# EasyEDA schematic SCH_Aether Zero_R0.5.json
TITLE: Aether Zero; REV: 0.4; Date: 2023-12-19; Sheet: 1/1; Drawn By: averseabfun; Company: (none)
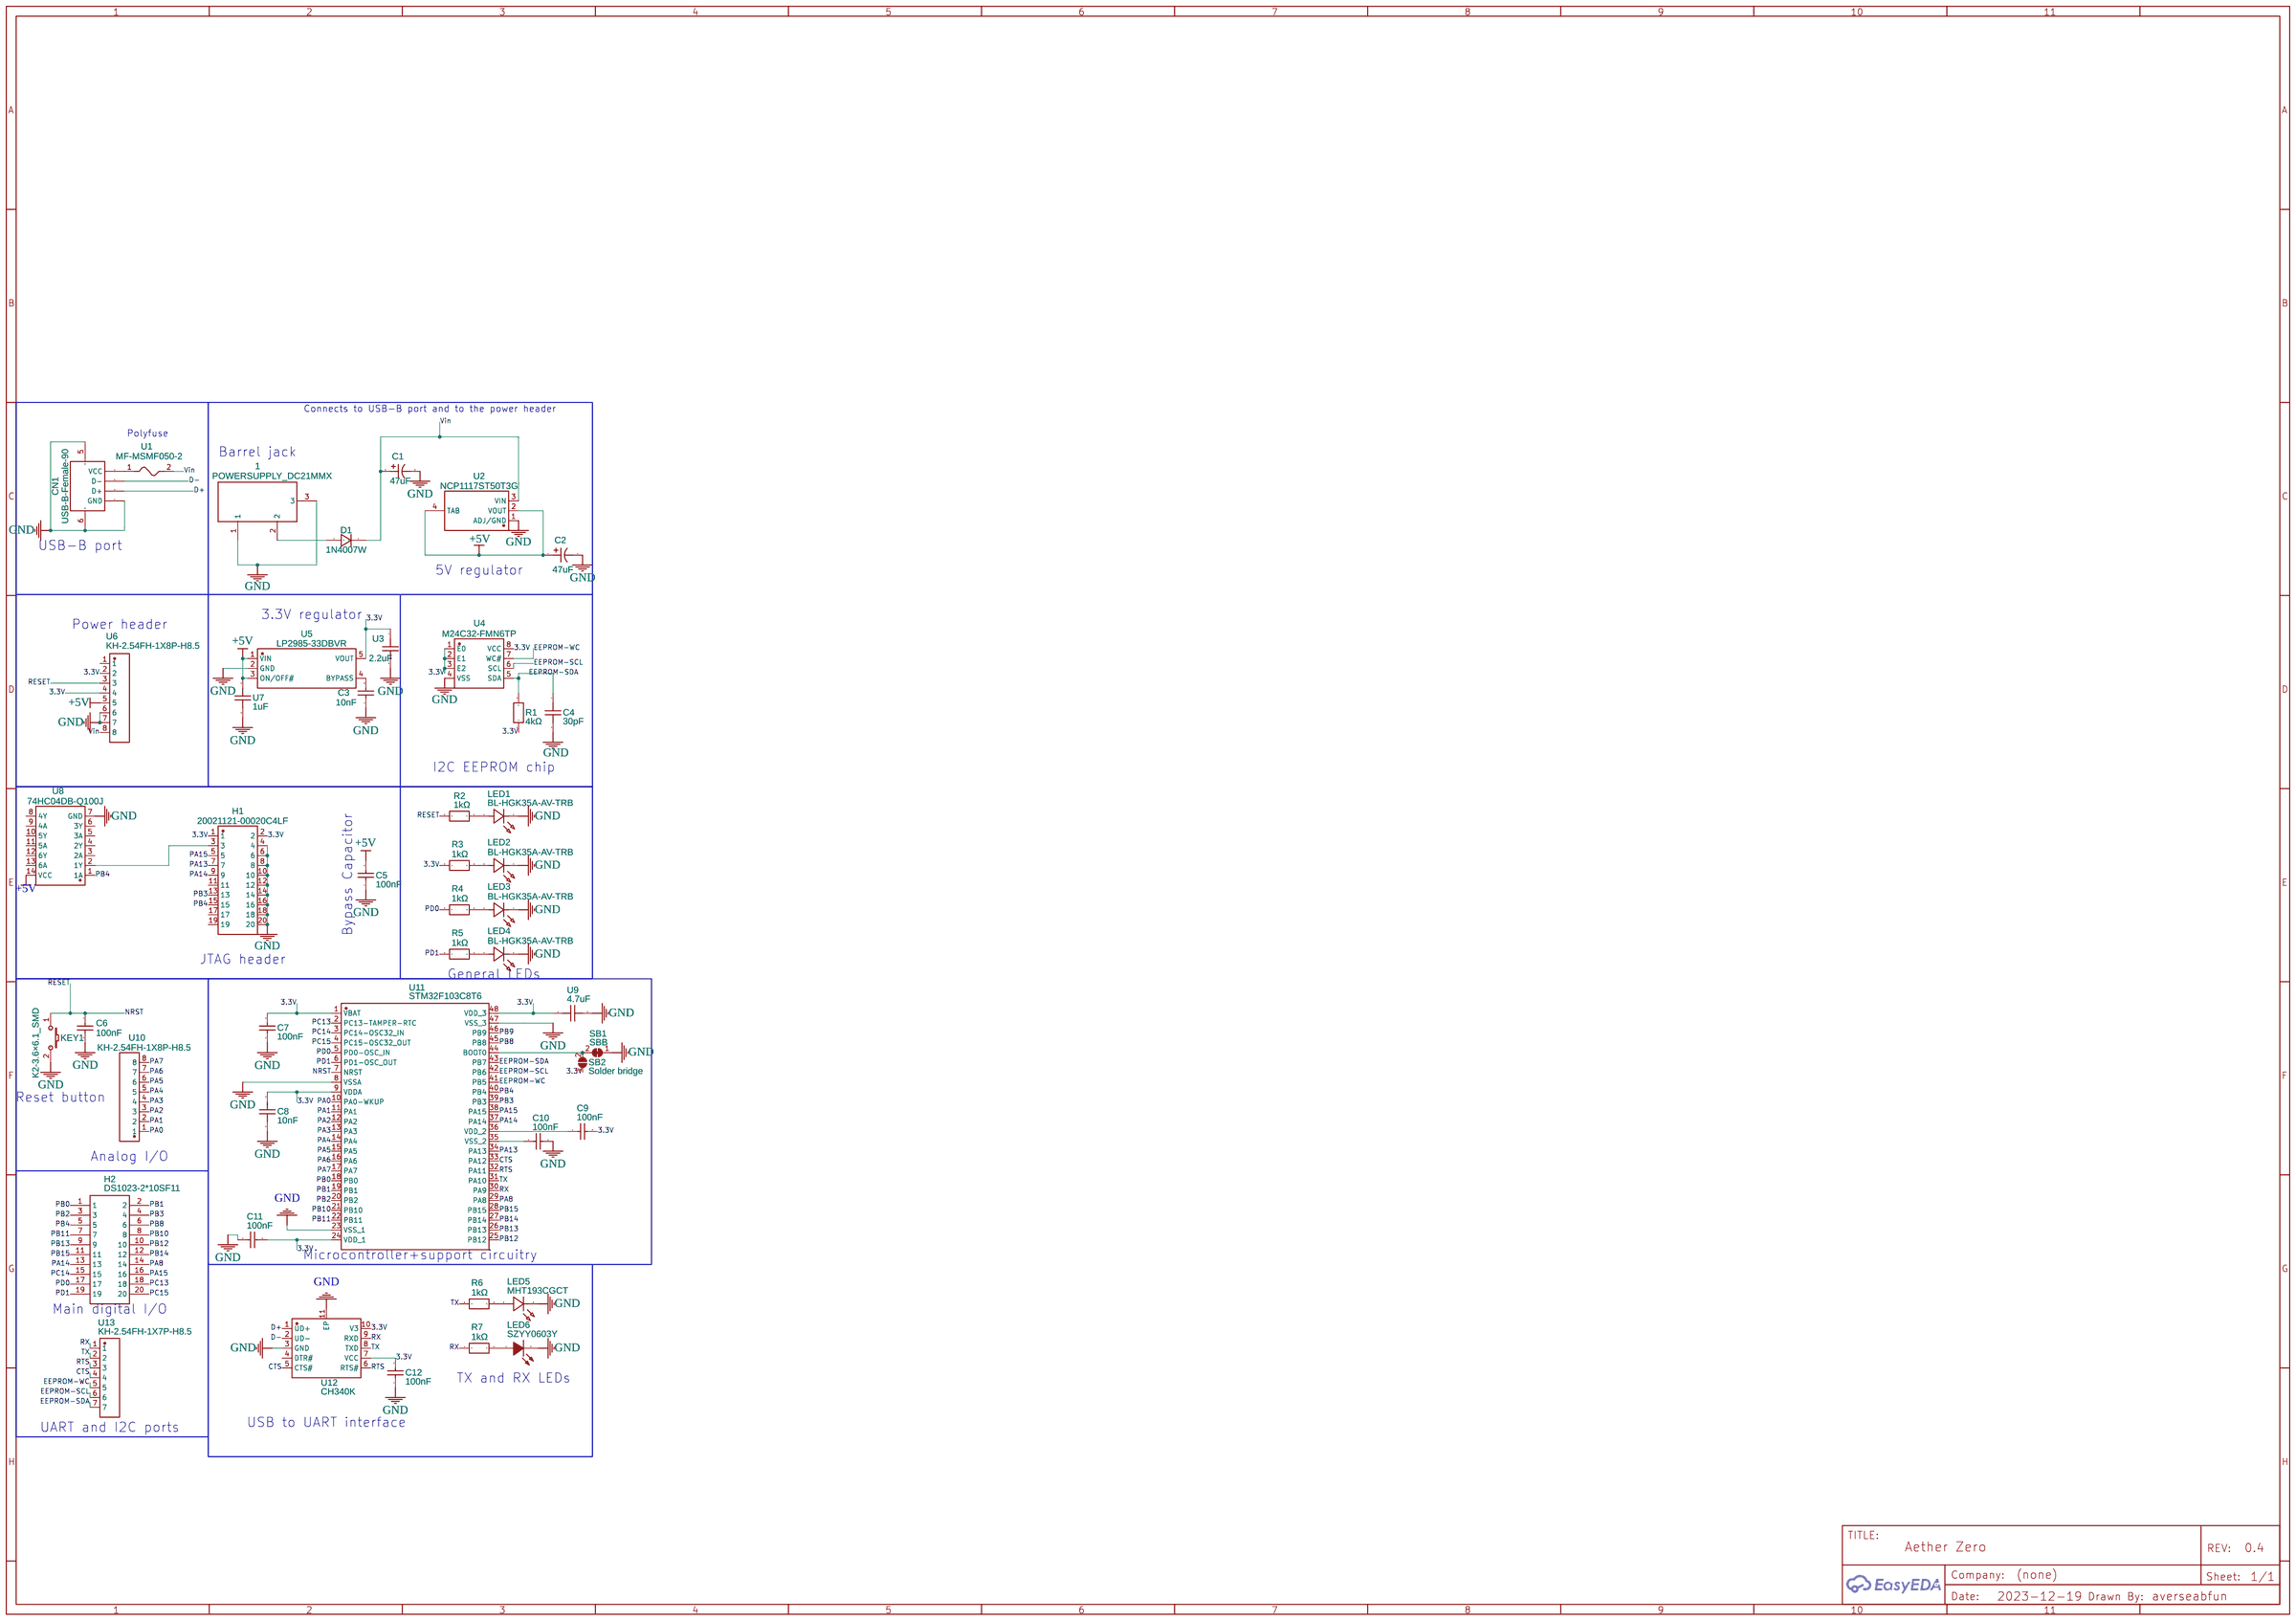
[diagram p0: schematic sheet]

## Parts
1  POWERSUPPLY_DC21MMX  [POWERSUPPLY_DC-21MM]
C1  47uF  [CAP-SMD_BD6.3-L6.6-W6.6-LS7.2-FD]
C2  47uF  [CAP-SMD_BD6.3-L6.6-W6.6-LS7.2-FD]
C3  10nF  [C0402]
C4  30pF  [C0402]
C5  100nF  [C0402]
C6  100nF  [C0402]
C7  100nF  [C0402]
C8  10nF  [C0805]
C9  100nF  [C0402]
C10  100nF  [C0402]
C11  100nF  [C0402]
C12  100nF  [C0402]
CN1  USB-B-Female-90  [USB-B_TH_USB-B-FEMALE-90]
D1  1N4007W  [SOD-123_L2.8-W1.8-LS3.7-RD]
H1  20021121-00020C4LF  [HDR-SMD_20P-P1.27-V-M-R2-C10-S1.27-LS5.5-1]
H2  DS1023-2*10SF11  [HDR-TH_20P-P2.54-V-F-R2-C10-S2.54]
KEY1  K2-3.6×6.1_SMD  [KEY-SMD_2P-L6.2-W3.6-LS8.0]
LED1  BL-HGK35A-AV-TRB  [LED0805-RD_GREEN]
LED2  BL-HGK35A-AV-TRB  [LED0805-RD_GREEN]
LED3  BL-HGK35A-AV-TRB  [LED0805-RD_GREEN]
LED4  BL-HGK35A-AV-TRB  [LED0805-RD_GREEN]
LED5  MHT193CGCT  [LED0603-RD_GREEN]
LED6  SZYY0603Y  [LED0603-R-RD-YELLOW]
R1  4kΩ  [R1206]
R2  1kΩ  [R0603]
R3  1kΩ  [R0603]
R4  1kΩ  [R0603]
R5  1kΩ  [R0603]
R6  1kΩ  [R0603]
R7  1kΩ  [R0603]
SB1  SBB  [SOLDER BRIDGE 2P BRIDGED]
SB2  Solder bridge  [SOLDER BRIDGE 2P UNBRIDGED]
U1  MF-MSMF050-2  [F1812]
U2  NCP1117ST50T3G  [SOT-223_L6.5-W3.5-P2.30-LS7.0-BR]
U3  2.2uF  [C0805]
U4  M24C32-FMN6TP  [SO-8_L4.9-W3.9-P1.27-LS6.0-BL]
U5  LP2985-33DBVR  [SOT-23-5_L2.9-W1.6-P0.95-LS2.8-TL]
U6  KH-2.54FH-1X8P-H8.5  [HDR-TH_8P-P2.54-V-F]
U7  1uF  [C1206]
U8  74HC04DB-Q100J  [SSOP-14_L6.2-W5.3-P0.65-LS7.8-BL]
U9  4.7uF  [C0603]
U10  KH-2.54FH-1X8P-H8.5  [HDR-TH_8P-P2.54-V-F]
U11  STM32F103C8T6  [LQFP-48_L7.0-W7.0-P0.50-LS9.0-BL]
U12  CH340K  [ESOP-10_L4.9-W3.9-P1.00-LS6.2-BL-EP]
U13  KH-2.54FH-1X7P-H8.5  [HDR-TH_7P-P2.54-V-F]

## Library data of the parts
1 = POWERSUPPLY_DC21MMX: Contributor: joserbraga
C1 C2 = RVT47UF35V67RV0039: Contributor: LCSC; Supplier: LCSC; Supplier Part: C2836440; Manufacturer: KNSCHA(科尼盛); JLCPCB Part Class: Extended Part; link: https://lcsc.com/eda_search?q=C2836440&%26type=1&ref=editor
C3 = 0402B103K500NT: Supplier: LCSC; Manufacturer: FH(风华); Supplier Part: C1524; JLCPCB Part Class: Extended Part
C4 = AC0402JRNPO9BN300: Contributor: LCSC; Supplier: LCSC; Supplier Part: C726127; Manufacturer: YAGEO(国巨); JLCPCB Part Class: Extended Part
C5-C7 C9-C12 = 0402B104K160NT: Supplier: LCSC; Manufacturer: FH(风华); Supplier Part: C41851; JLCPCB Part Class: Extended Part; link: https://lcsc.com/eda_search?q=C41851&%26type=1&ref=editor
C8 = CC0805KRX7R8BB103: Contributor: LCSC; Supplier: LCSC; Supplier Part: C519911; Manufacturer: YAGEO(国巨); JLCPCB Part Class: Extended Part
CN1 = USB-B-Female-90: Supplier: LCSC; Manufacturer: 精拓金; Manufacturer Part: 921-111A1010D10200; Supplier Part: C46392; JLCPCB Part Class: Extended Part; link: https://lcsc.com/eda_search?q=C46392&%26type=1&ref=editor
D1 = 1N4007W: Supplier: LCSC; Supplier Part: C328592; Manufacturer: BLUE ROCKET; Contributor: LCEDA_Lib
H1 = 20021121-00020C4LF: Contributor: LCSC; Supplier: LCSC; Supplier Part: C239061; Manufacturer: Amphenol; JLCPCB Part Class: Extended Part
H2 = DS1023-2*10SF11: Contributor: LCSC; Supplier: LCSC; Manufacturer: CONNFLY; Supplier Part: C92266; JLCPCB Part Class: Extended Part
KEY1 = K2-3.6×6.1_SMD: Supplier Part: C118141; Supplier: LCSC; Manufacturer Part: K2-1107ST-A4SW-06; Contributor: LCEDA_Lib; 制造商: 韩国韩荣
LED1-LED4 = BL-HGK35A-AV-TRB: Contributor: lcsc; Supplier: LCSC; Supplier Part: C5123492; Manufacturer: BrtLed(佰鸿); JLCPCB Part Class: Extended Part; link: https://lcsc.com/eda_search?q=C5123492&%26type=1&ref=editor
LED5 = MHT193CGCT: Contributor: lcsc; Supplier: LCSC; Supplier Part: C2962098; Manufacturer: MEIHUA(美华); JLCPCB Part Class: Extended Part
LED6 = SZYY0603Y: Contributor: LCSC; Supplier: LCSC; Supplier Part: C434424; Manufacturer: yongyu(永裕光电); JLCPCB Part Class: Extended Part
R1 = RN732BTTD4001B25: Contributor: LCSC; Supplier: LCSC; Supplier Part: C782230; Manufacturer: KOA; JLCPCB Part Class: Extended Part
R2-R7 = CR-03JA7----1K: Contributor: LCSC; Supplier: LCSC; Supplier Part: C881898; Manufacturer: Viking Tech; JLCPCB Part Class: Extended Part; link: https://lcsc.com/eda_search?q=C881898&%26type=1&ref=editor
SB1 = SBB: Contributor: Giovanni Lenzi
SB2 = Solder bridge: Contributor: pipizl8981; Manufacturer Part: DNP; Manufacturer: DNP
U1 = MF-MSMF050-2: Supplier: LCSC; Manufacturer: BOURNS; Supplier Part: C17313; JLCPCB Part Class: Extended Part; link: https://lcsc.com/eda_search?q=C17313&%26type=1&ref=editor
U2 = NCP1117ST50T3G: Supplier: LCSC; Manufacturer: onsemi(安森美); Supplier Part: C17314; JLCPCB Part Class: Extended Part; link: https://lcsc.com/eda_search?q=C17314&%26type=1&ref=editor
U3 = 0805X225K250CT_C5122273: Contributor: lcsc; Supplier: LCSC; Supplier Part: C5122273; Manufacturer: Walsin(华新科); Manufacturer Part: 0805X225K250CT; JLCPCB Part Class: Extended Part
U4 = M24C32-FMN6TP: Contributor: LCSC; Supplier: LCSC; Supplier Part: C2061453; Manufacturer: ST(意法半导体); JLCPCB Part Class: Extended Part
U5 = LP2985-33DBVR: Supplier: LCSC; Manufacturer: TI(德州仪器); Supplier Part: C95414; JLCPCB Part Class: Extended Part; link: https://lcsc.com/eda_search?q=C95414&%26type=1&ref=editor
U6 U10 = KH-2.54FH-1X8P-H8.5: Contributor: LCSC; Supplier: LCSC; Supplier Part: C2905417; Manufacturer: kinghelm(金航标); JLCPCB Part Class: Extended Part; link: https://lcsc.com/eda_search?q=C2905417&%26type=1&ref=editor
U7 = CGA5L3X8R1H105KT0Y0N: Contributor: lcsc; Supplier: LCSC; Supplier Part: C342628; Manufacturer: TDK; JLCPCB Part Class: Extended Part
U8 = 74HC04DB-Q100J: Contributor: LCSC; Supplier: LCSC; Supplier Part: C546498; Manufacturer: Nexperia(安世); JLCPCB Part Class: Extended Part
U9 = CSA0603X5R475K6R3JT: Contributor: lcsc; Supplier: LCSC; Supplier Part: C3015159; Manufacturer: HRE(芯声); JLCPCB Part Class: Extended Part
U11 = STM32F103C8T6: Supplier: LCSC; Manufacturer: ST(意法半导体); Supplier Part: C8734; JLCPCB Part Class: Basic Part
U12 = CH340K: Contributor: LCSC; Supplier: LCSC; Supplier Part: C968586; Manufacturer: WCH(南京沁恒); JLCPCB Part Class: Extended Part
U13 = KH-2.54FH-1X7P-H8.5: Contributor: LCSC; Supplier: LCSC; Supplier Part: C2932672; Manufacturer: kinghelm(金航标); JLCPCB Part Class: Extended Part

## Nets
3.3V: C7.1 C8.2 C9.2 C11.2 C12.2 H1.1 H1.2 R1.1 R3.1 SB2.1(A) U3.1 U4.1(E0) U4.2(E1) U4.3(E2) U4.8(VCC) U5.5(VOUT) U6.2 U6.4 U9.1 U11.1(VBAT) U11.9(VDDA) U11.24(VDD_1) U11.48(VDD_3) U12.7(VCC) U12.10(V3)
+5V: C2.1 C5.2 U2.2(VOUT) U2.4(TAB) U5.1(VIN) U5.3(ON/OFF#) U6.5 U7.2 U8.14(VCC)
GND: 1.1 1.3 C1.2 C2.2 C3.1 C4.2 C5.1 C6.2 C7.2 C8.1 C10.2 C11.1 C12.1 CN1.4(GND) CN1.5(SH1) CN1.6(SH2) H1.4 H1.6 H1.8 H1.10 H1.12 H1.14 H1.16 H1.18 H1.20 KEY1.2 LED1.1(K) LED2.1(K) LED3.1(K) LED4.1(K) LED5.1(K) LED6.2(-) SB1.1(A) U2.1(ADJ/GND) U3.2 U4.4(VSS) U5.2(GND) U6.6 U6.7 U7.1 U8.7(GND) U9.2 U11.8(VSSA) U11.23(VSS_1) U11.47(VSS_3) U12.3(GND) U12.11(EP)
Vin: C1.1 D1.1 U1.2 U2.3(VIN) U6.8
CTS: U11.33(PA12) U12.5(CTS#) U13.4
D+: CN1.3(D+) U12.1(UD+)
D-: CN1.2(D-) U12.2(UD-)
EEPROM-SCL: U4.6(SCL) U11.42(PB6) U13.6
EEPROM-SDA: C4.1 R1.2 U4.5(SDA) U11.43(PB7) U13.7
EEPROM-WC: U4.7(WC#) U11.41(PB5) U13.5
NRST: C6.1 KEY1.1 R2.2 U6.3 U11.7(NRST)
PA0: U10.1 U11.10(PA0-WKUP)
PA1: U10.2 U11.11(PA1)
PA2: U10.3 U11.12(PA2)
PA3: U10.4 U11.13(PA3)
PA4: U10.5 U11.14(PA4)
PA5: U10.6 U11.15(PA5)
PA6: U10.7 U11.16(PA6)
PA7: U10.8 U11.17(PA7)
PA8: H2.14 U11.29(PA8)
PA13: H1.7 U11.34(PA13)
PA14: H1.9 H2.13 U11.37(PA14)
PA15: H1.5 H2.16 U11.38(PA15)
PB0: H2.1 U11.18(PB0)
PB1: H2.2 U11.19(PB1)
PB2: H2.3 U11.20(PB2)
PB3: H1.13 H2.4 U11.39(PB3)
PB4: H1.15 H2.5 U8.1(1A) U11.40(PB4)
PB8: H2.6 U11.45(PB8)
PB9: U11.46(PB9)
PB10: H2.8 U11.21(PB10)
PB11: H2.7 U11.22(PB11)
PB12: H2.10 U11.25(PB12)
PB13: H2.9 U11.26(PB13)
PB14: H2.12 U11.27(PB14)
PB15: H2.11 U11.28(PB15)
PC13: H2.18 U11.2(PC13-TAMPER-RTC)
PC14: H2.15 U11.3(PC14-OSC32_IN)
PC15: H2.20 U11.4(PC15-OSC32_OUT)
PD0: H2.17 R4.1 U11.5(PD0-OSC_IN)
PD1: H2.19 R5.1 U11.6(PD1-OSC_OUT)
RTS: U11.32(PA11) U12.6(RTS#) U13.3
RX: R7.1 U11.30(PA9) U12.9(RXD) U13.1
TX: R6.1 U11.31(PA10) U12.8(TXD) U13.2
Net-(1-2): 1.2 D1.2
Net-(C3-2): C3.2 U5.4(BYPASS)
Net-(C9-1): C9.1 U11.36(VDD_2)
Net-(C10-1): C10.1 U11.35(VSS_2)
Net-(CN1-1): CN1.1(VCC) U1.1
Net-(H1-3): H1.3 U8.2(1Y)
Net-(LED1-2): LED1.2(A) R2.1
Net-(LED2-2): LED2.2(A) R3.2
Net-(LED3-2): LED3.2(A) R4.2
Net-(LED4-2): LED4.2(A) R5.2
Net-(LED5-2): LED5.2(A) R6.2
Net-(LED6-1): LED6.1(+) R7.2
Net-(SB1-2): SB1.2(B) SB2.2(B) U11.44(BOOT0)

Not connected (* = marked no-connect by the designer): H1 11 17 19; U6 1; U8 3(2A) 4(2Y) 5(3A) 6(3Y) 8(4Y) 9(4A) 10(5Y) 11(5A) 12(6Y) 13(6A); U12 4(DTR#)

## Notes on the sheet
- Connects to USB-B port and to the power header
- Polyfuse
- Barrel jack
- USB-B port
- 5V regulator
- 3.3V regulator
- Power header
- I2C EEPROM chip
- Bypass Capacitor
- JTAG header
- General LEDs
- Reset button
- Analog I/O
- Microcontroller+support circuitry
- Main digital I/O
- TX and RX LEDs
- UART and I2C ports
- USB to UART interface
